# Altium schematic sheet Power.SchDoc
size A4; Author: Frederic Emmerth; DrawnBy: Frederic Emmerth; Organization: GFR; DocumentNumber: 4; SheetNumber: 4; SheetTotal: 9
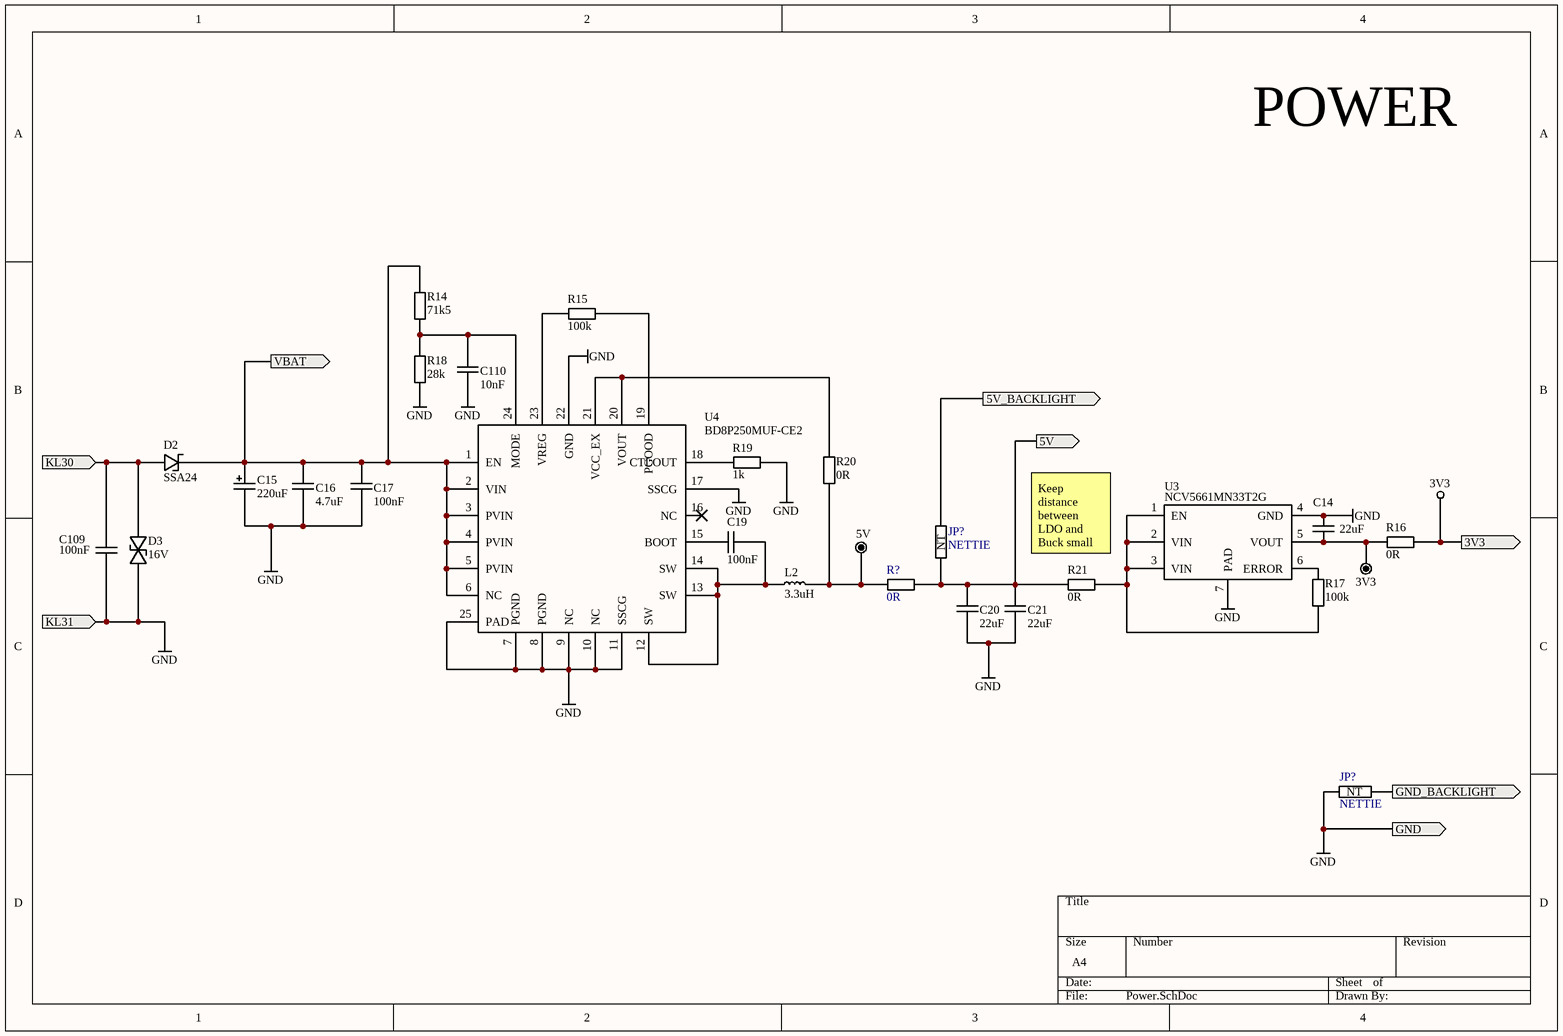
[diagram p0: Power.SchDoc]

## Parts
(Parts that share a designator on the sheet are numbered #1, #2 ... from top to bottom, then left to right.)
C14  22uF  [C_1210]
C15  220uF  [MAL225099909E3]
C16  4.7uF  [C_1210]
C17  100nF  [C_0402]
C19  100nF  [C_0402]
C20  22uF  [C_1210]
C21  22uF  [C_1210]
C109  100nF  [C_0402]
C110  10nF  [C_0402]
D2  SSA24  [SSA24]
D3  16V  [SM30T19CAY]
JP2  TestpointName: 3V3  [Manual Testpoint]  (hidden comment: Testpoint)
JP3  TestpointName: 5V  [Manual Testpoint]  (hidden comment: Testpoint)
JP?#1  NETTIE  [NETTIE]
JP?#2  NETTIE  [NETTIE]
L2  3.3uH  [CLF6045NIT-3R3N-D]
R14  71k5  [R_0402]
R15  100k  [R_0402]
R16  0R  [R_1210]
R17  100k  [R_0402]
R18  28k  [R_0402]
R19  1k  [R_0402]
R20  0R  [R_1210]
R21  0R  [R_1210]
R?  0R  [R_1210]
U3  NCV5661MN33T2G  [NCV5661MN33T2G]
U4  BD8P250MUF-CE2  [BD8P250MUF-CE2]

## Ports
3V3 (out), 5V (out), 5V_BACKLIGHT (out), GND (out), GND_BACKLIGHT (out), KL30 (in), KL31 (in), VBAT (out)

## Nets
3V3: R16.2 ; port 3V3
GND: C14.2 C15.2 C16.1 C17.1 C20.1 C21.1 C109.1 C110.1 D3.1 JP?#2.1 R18.1 R19.2 U3.4(GND) U3.7(PAD) U4.7(PGND) U4.8(PGND) U4.9(NC) U4.10(NC) U4.11(SSCG) U4.17(SSCG) U4.22(GND) U4.25(PAD) ; port KL31, port GND
5V: C20.2 C21.2 JP?#1.1 R21.2 R?.2 ; port 5V
5V_BACKLIGHT: JP?#1.2 ; port 5V_BACKLIGHT
GND_BACKLIGHT: JP?#2.2 ; port GND_BACKLIGHT
KL30: C109.2 D2.2 D3.2 ; port KL30
VBAT: C15.1 C16.2 C17.2 D2.1 R14.2 U4.1(EN) U4.2(VIN) U4.3(PVIN) U4.4(PVIN) U4.5(PVIN) U4.6(NC) ; port VBAT
NetC14_1: C14.1 JP2.1 R16.1 U3.5(VOUT)
NetC19_1: C19.1 U4.15(BOOT)
NetC19_2: C19.2 L2.1 U4.12(SW) U4.13(SW) U4.14(SW)
NetC110_2: C110.2 R14.1 R18.2 U4.24(MODE)
NetJP3_1: JP3.1 L2.2 R20.1 R?.1
NetR15_1: R15.1 U4.23(VREG)
NetR15_2: R15.2 U4.19(PGOOD)
NetR17_1: R17.1 R21.1 U3.1(EN) U3.2(VIN) U3.3(VIN)
NetR17_2: R17.2 U3.6(ERROR)
NetR19_1: R19.1 U4.18(CTLOUT)
NetR20_2: R20.2 U4.20(VOUT) U4.21(VCC_EX)

Not connected (* = marked no-connect by the designer): U4 16(NC)*

## Notes on the sheet
- POWER
- (near R21) Keep distance between LDO and Buck small
- (in symbol NETTIE) NT

## Library data of the parts
C14 C20 C21 = GCM32ER71A226KE12L: 22uF 10V X7R
C15 = MAL225099909E3: 220uF 100V
C16 = GCJ32ER71H475KA12L: 4.7uF 50V X7R
C17 C19 C109 = CGA2B3X7R1H104K050BE: 100nF 50V X7R
C110 = GCM155R71H103KA55D: 10nF 50V 0402 X7R
D2 = SSA24: 40V 2A 500mV
D3 = SM30T19CAY: 16V 31.5V
JP2 JP3 = Manual Testpoint
JP?#1 JP?#2 = NETTIE: 4-Way Net Tie
L2 = CLF6045NIT-3R3N-D: 3.3uH 19mohms 3.5A
R14 = MCMR04X7152FTL: 71k5 1% 62.5mW
R15 R17 = CRCW0402100KJNED: 100k 5% 62.5mW
R16 R20 R21 R? = RK73Z2ETTD.: 0R 10A
R18 = MCMR04X2802FTL: 28k 1% 62.5mW
R19 = ESR01MZPJ102: 1k 5% 200mW
U3 = NCV5661MN33T2G: 3V3 LDO
U4 = BD8P250MUF-CE2: Buck Regulator